# Altium schematic sheet power.SchDoc
size 558 x 431 mm; SheetNumber: 2; SheetTotal: 2
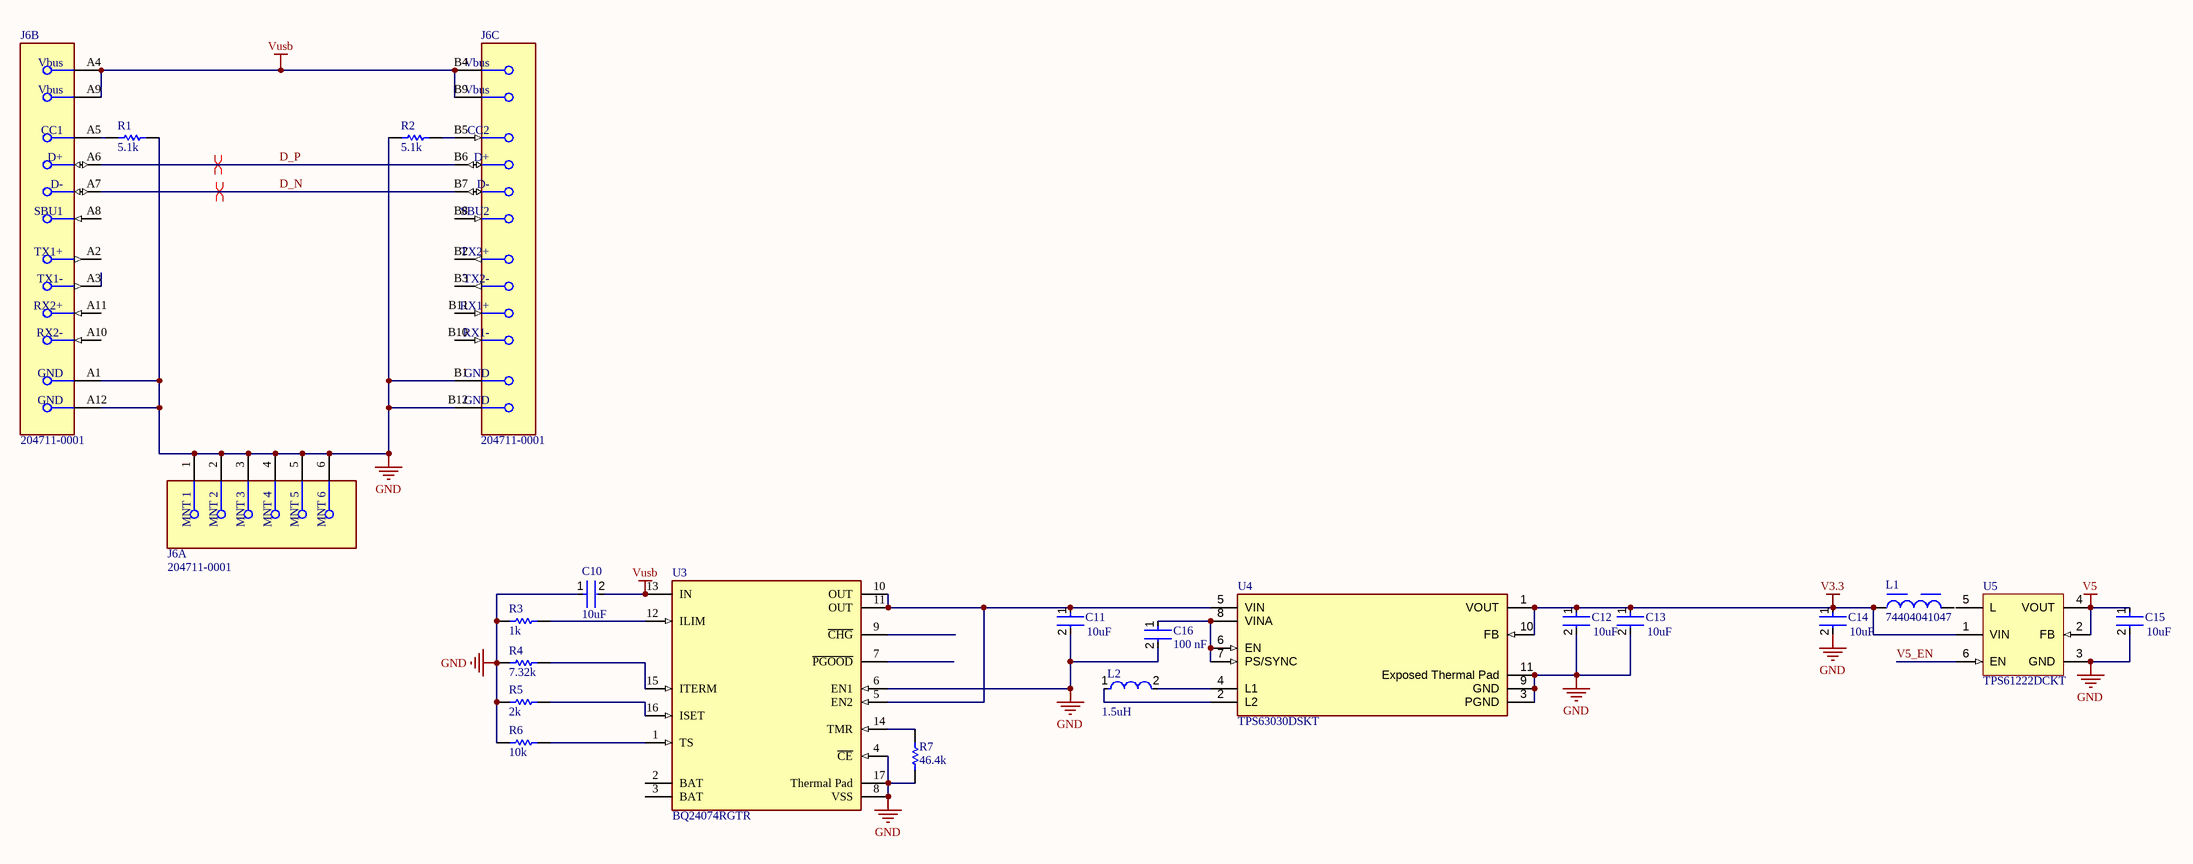
[diagram p0: power.SchDoc]

## Parts
C10  Capacitance: 10uF  [FP-GRM21B-0_1-IPC_C]  (hidden comment: GRM21BR61C106KE15L)
C11  Capacitance: 10uF  [FP-GRM21B-0_1-IPC_C]  (hidden comment: GRM21BR61C106KE15L)
C12  Capacitance: 10uF  [FP-GRM21B-0_1-IPC_C]  (hidden comment: GRM21BR61C106KE15L)
C13  Capacitance: 10uF  [FP-GRM21B-0_1-IPC_C]  (hidden comment: GRM21BR61C106KE15L)
C14  Capacitance: 10uF  [FP-GRM21B-0_1-IPC_C]  (hidden comment: GRM21BR61C106KE15L)
C15  Capacitance: 10uF  [FP-GRM21B-0_1-IPC_C]  (hidden comment: GRM21BR61C106KE15L)
C16  value 100 nF  [FP-CC0805-0_85-MFG]  (hidden comment: CC0805KRX7R7BB104)
J6  204711-0001  [FP-204711-0001-MFG]  (parts A,B,C of 3)
L1  74404041047  [WE-LQS_4012]
L2  Inductance: 1.5uH  [FP-LQM2MPN_EH-MFG]  (hidden comment: LQM2MPN1R5MEHL)
R1  value 5.1k  [RESC2013X70X40NL20T20]  (hidden comment: ERJ-6GEYJ512V)
R2  value 5.1k  [RESC2013X70X40NL20T20]  (hidden comment: ERJ-6GEYJ512V)
R3  value 1k  [RESC2013X50X30NL20T20]  (hidden comment: CRCW08051K00FKEA)
R4  value 7.32k  [RESC2013X70X40ML20T20]  (hidden comment: ERJ-6ENF7321V)
R5  value 2k  [RESC2013X70X40NL20T20]  (hidden comment: ERJ-6ENF2001V)
R6  value 10k  [RESC2013X70X40LL20T20]  (hidden comment: ERJ-6GEYJ103V)
R7  value 46.4k  [RESC2013X70X40NL20T20]  (hidden comment: ERJ-6ENF4642V)
U3  BQ24074RGTR  [FP-RGT0016C-IPC_B]
U4  TPS63030DSKT  [FP-DSK0010A-IPC_B]
U5  TPS61222DCKT  [DCK0006A_N]

## Nets
GND: C10.1 C11.2 C12.2 C13.2 C14.2 C15.2 C16.2 J6.1(MNT_1) J6.2(MNT_2) J6.3(MNT_3) J6.4(MNT_4) J6.5(MNT_5) J6.6(MNT_6) J6.A1(GND) J6.A12(GND) J6.B1(GND) J6.B12(GND) R1.2 R2.1 R3.1 R4.2 R5.1 R6.1 R7.1 U3.4(~{CE}) U3.6(EN1) U3.8(VSS) U3.17(Thermal_Pad) U4.3(PGND) U4.9(GND) U4.11(Exposed_Thermal_Pad) U5.3(GND)
V3.3: C12.1 C13.1 C14.1 L1.1 U4.1(VOUT) U4.10(FB) U5.1(VIN)
V5: C15.1 U5.2(FB) U5.4(VOUT)
Vusb: C10.2 J6.A4(Vbus) J6.A9(Vbus) J6.B4(Vbus) J6.B9(Vbus) U3.13(IN)
D_N: J6.A7(D-) J6.B7(D-)
D_P: J6.A6(D+) J6.B6(D+)
V5_EN: U5.6(EN)
NetC11_1: C11.1 U3.5(EN2) U3.10(OUT) U3.11(OUT) U4.5(VIN)
NetC16_1: C16.1 U4.6(EN) U4.7(PS/SYNC) U4.8(VINA)
NetJ6_A5: J6.A5(CC1) R1.1
NetJ6_B5: J6.B5(CC2) R2.2
NetL2_1: L2.1 U4.2(L2)
NetL2_2: L2.2 U4.4(L1)
NetR3_2: R3.2 U3.12(ILIM)
NetR4_1: R4.1 U3.15(ITERM)
NetR5_2: R5.2 U3.16(ISET)
NetR6_2: R6.2 U3.1(TS)
NetR7_2: R7.2 U3.14(TMR)

Not connected (* = marked no-connect by the designer): J6 A2(TX1+) A3(TX1-) A8(SBU1) A10(RX2-) A11(RX2+) B2(TX2+) B3(TX2-) B8(SBU2) B10(RX1-) B11(RX1+); L1 2; U3 2(BAT) 3(BAT) 7(~{PGOOD}) 9(~{CHG}); U5 5(L)

## Layout directives
differential pair: D_N, D_P

## Notes on the sheet
- DWG. NO.
- REV.
- SHT.
- REVISION
- DESCRIPTION
- DATE
- APPROVED
- THIS DOCUMENT AND THE DATA DISCLOSED HEREIN OR HEREWITH IS THE PROPERTY OF ALTIUM LIMITED AND MAY BE FREELY DISTRIBUTED IN WHOLE. NO RIGHTS ARE RESERVED OR EXPRESS OR IMPLIED WARANTEE GIVEN.
- ENG:
- DSN:
- APPROVALS
- PROJECT
- DOCUMENT REVISION:
- DESIGN ITEM:
- CHK:
- BOM:
- REFERENCE DOCUMENTS
- PROJECT REVISION:
- TITLE
- FAB DWG:
- PCB DWG:
- ASSY DWG:
- SCALE:
- SIZE
- C
- CAGE CODE
- FILE NAME
- DWG NO.
- SHEET
- OF
- REV

## Library data of the parts
C10-C15 = CMP-2007-03453-2: Chip Multilayer Ceramic Capacitors for General Purpose, 0805, 10uF, X5R, 15%, 10%, 16V; Radiation Hardening: No; Thickness: 0.053inch; Voltage Rating (DC): 16V; Lead Free: Lead Free; Package Quantity: 1; Width: 1.25mm; Case Code (Imperial): 0805; Depth: 1.25mm; Packaging: Tape and Reel; Dielectric: X5R; Max Operating Temperature: 85°C; Tolerance: 10%; Voltage Rating: 16V; Voltage: 16V; Height: 1.25mm; Case Code (Metric): 2012; Material: Ceramic; Mount: Surface Mount; Case/Package: 0805; REACH SVHC: No SVHC; Length: 2mm; Min Operating Temperature: -55°C; Termination: SMD/SMT
C16 = CMP-1036-04402-6: CAP CER 0.1UF 16V X7R 0805; Manufacturer: Yageo; Material: Ceramic; Tolerance: 0.1; Manufacturer Part Number: CC0805KRX7R7BB104; Temperature: -30°C to +85°C; Lead Free: Yes; Footprint Url: http://www.yageo.com/exep/pages/download/literatures/UPY-C_GEN_24.pdf; Voltage Rating: 16 V; Package: CC0805-0.85; RoHS: TRUE; Digikey Description: CAP CER 0.1UF 16V X7R 0805; Category: Cap; Octopart: https://octopart.com/cc0805krx7r7bb104-yageo-39467769; Capacitance: 100 nF; Device Class L3: Ceramic Capacitors; ComponentLink2URL: http://www.yageo.com/documents/recent/UPY-GPHC_Y5V_6.3V-to-50V_8.pdf; Temperature Range Low: -30°C; Mouser Description: Multilayer Ceramic Capacitors MLCC - SMD/SMT 100nF 16V X7R 10%; Automotive: No; Device Class L2: Capacitors; Height: 0.95mm; ComponentLink2Description: Datasheet; Temperature Characteristic: X7R; Ipc Land Pattern Name: CAPC200125X85; Device Class L1: Passive Components; Temperature Range High: +85°C
J6 = CMP-04767-000011-1: USB VERTICAL TYPE C 3.1
L1 = CMP-03913-61645198-1: 74404041047 Inductors, Fixed, WE-LQS SMD 4012 4.7uH 1.55A 91mOhms; Test Frequency: 100kHz; Inductance Tolerance: 20%; Shielding: Shielded; DC Resistance (DCR): 91mΩ; Self Resonant Frequency: 55MHz; Inductance: 4.7µH; Saturation Current: 1.9A; Packaging: Tape & Reel (TR); Composition: Wirewound; Tolerance: 20%; Ambient Temperature Range Low: -40°C; Length: 4mm; Case/Package: Nonstandard; Height: 1.2mm; Min Operating Temperature: -40°C; Ambient Temperature Range High: 85°C; Width: 4mm; Current Rating: 1.55A; Max Operating Temperature: 125°C; Height - Seated (Max): 1.1938mm; Mount: Surface Mount; NexarPartId: 61645198; RoHS: Compliant
L2 = CMP-06042-000249-1: FIXED IND 1.5UH 1.45A 150 MOHM; Tolerance: 20%; Shielding: Unshielded; Core Material: Ferrite; DC Resistance (DCR): 150mR; Test Frequency: 1MHz; Saturation Current: 1.2A; Self Resonant Frequency: 40MHz; Case Code (Metric): 2016; Packaging: Tape and Reel; Mount: Surface Mount; Case Code (Imperial): 0806; Case/Package: 0806; Length: 0.079inch; Height - Seated (Max): 0.031inch; Width: 0.063inch; Max Operating Temperature: 85°C; Current Rating: 1.45A; Min Operating Temperature: -40°C
R1 R2 = CMP-2001-00427-1: Manufacturer: Panasonic; Part Number: ERJ-6GEYJ512V
R3 = CMP-1013-00510-2: Manufacturer: Vishay Dale; Part Number: CRCW08051K00FKEA
R4 = CMP-1013-00608-2: Manufacturer: Panasonic; Part Number: ERJ-6ENF7321V
R5 = CMP-2001-00026-5: Chip Resistor, 2 KOhm, +/- 1%, 0.125 W, -55 to 155 degC, 0805 (2012 Metric), RoHS, Tape and Reel; Manufacturer: Panasonic; Voltage Rating: 150 V; RoHSCompliant: true; Packaging: Tape and Reel; ComponentLink2Description: Datasheet; DatasheetVersion: 04/2015; Min Operating Temperature: -55 degC; Max Operating Temperature: 155 degC; Mounting Technology: Surface Mount; Length: 2 mm; Package Quantity: 5000; REACH SVHC: Unknown; ComponentLink1URL: http://www.panasonic.com/; ComponentLink2URL: http://industrial.panasonic.com/cdbs/www-data/pdf/RDA0000/AOA0000C86.pdf; Mount: Surface Mount; PackageReference: 0805; ComponentLink1Description: Manufacturer URL; PackageDescription: 2-Pin Surface Mount Device, Body 2 x 1.25 mm; Height: 0.6 mm
R6 = CMP-2001-00337-1: Manufacturer: Panasonic; Part Number: ERJ-6GEYJ103V
R7 = CMP-2001-00198-1: Manufacturer: Panasonic; Part Number: ERJ-6ENF4642V
U3 = CMP-0321-00220-3: IC LI-ION CHARGE MGMT 16-QFN; Fault Protection: Over Voltage; Max Charge Current: 1.5A; Interface: USB; Max Supply Voltage: 10.2V; Number of Cells: 1; Battery Pack Voltage: 4.2V; Min Supply Voltage: 4.35V; Battery Chemistry: LITHIUM-ION; Min Input Voltage: 4.3V; Lead Free: Lead Free; Max Operating Temperature: 125°C; RoHS Compliant: Yes; Contact Plating: Gold; Min Operating Temperature: -40°C; Weight: 0.000808oz; Package Quantity: 3000; Radiation Hardening: No; Case/Package: VQFN; Output Voltage: 4.2V; Packaging: Tape and Reel; Series: -; Output Current: 1.5A; Number of Pins: 16
U4 = CMP-0349-00012-4: IC REG BCK BST ADJ 900MA 10SON; Output Current: 800mA; Operating Supply Voltage: 5.5V; Min Input Voltage: 1.8V; Switching Frequency: 2.4MHz; Output Type: Adjustable; Quiescent Current: 25uA; Min Output Voltage: 1.2V; Topology: Buck-Boost; Number of Outputs: 1; Efficiency: 96%; Synchronous Rectifier: Yes; Lead Free: Lead Free; Max Operating Temperature: 85°C; Number of Pins: 10; Termination: SMD/SMT; Min Operating Temperature: -40°C; Width: 2.5mm; Frequency: 2.4MHz; Min Supply Voltage: 1.8V; Package Quantity: 1; Radiation Hardening: No; Max Output Voltage: 5.5V; Max Input Voltage: 5.5V; Packaging: Tape and Reel; Max Output Current: 800mA; Length: 2.5mm; Output Voltage: 5.5V; REACH SVHC: No SVHC; Height: 0.75mm
U5 = CMP-0343-00079-2: Boost Voltage Converter with 0.7 to 5.5 V Input and 5 V Output, -40 to 85 degC, 6-Pin SC70 (DCK), Green (RoHS & no Sb/Br); Manufacturer: Texas Instruments; Vin(Min)(V): 0.7; Vout(Max)(V): 5; SubFamily: Step-Up Regulator; Regulated Outputs(#): 1; Vin(Max)(V): 5.5; Switching Frequency(Max)(kHz): 2000; Eco-Plan: Green (RoHS & no Sb/Br); ComponentLink1URL: http://www.ti.com/general/docs/lit/getliterature.tsp?genericPartNumber=TPS61222&fileType=pdf; Topology: Boost; Code_JEDEC: MO-203-AB; DatasheetVersion: SLVS776; ComponentLink2Description: Package Specification; ComponentLink1Description: Datasheet; PackageVersion: revG, Jan-2007; PackageDescription: 6-Pin Plastic Small-Outline Package, 2 x 1.3 mm Body, 0.65 mm Pitch, 2.1 mm Lead Span; Vout(Min)(V): 5; ComponentLink2URL: http://www.ti.com/litv/pdf/mpds114c; PackageReference: DCK0006A; Mounting Technology: Surface Mount; PartNumber: TPS61222DCKT